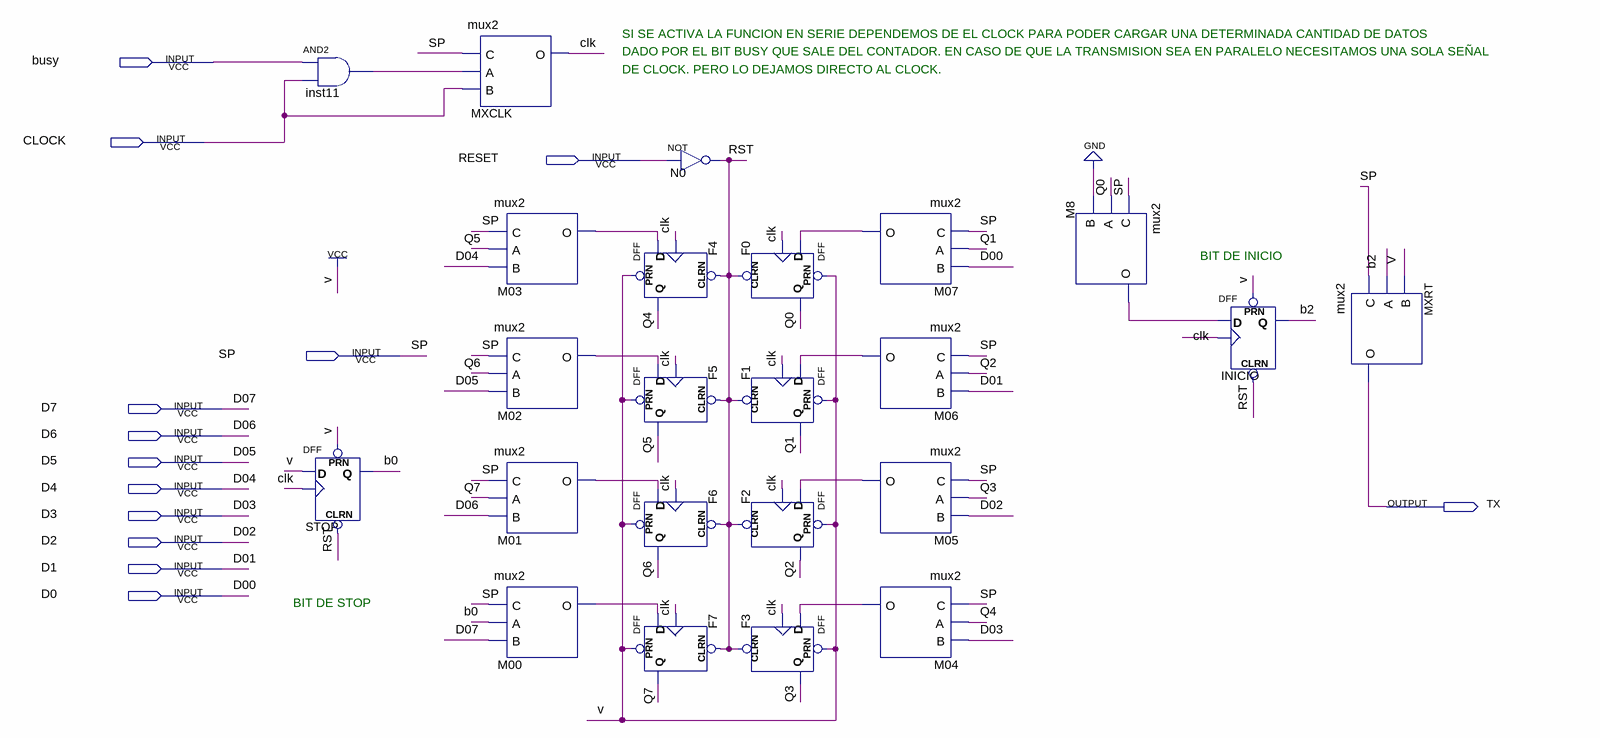
[diagram p0: schematic sheet]
// Quartus schematic Transmisor.bdf as structural Verilog: 23 symbols, 13 pins
module Transmisor (
  input  busy,
  input  CLOCK,
  input  RESET,
  input  SP,
  input  D7,
  input  D6,
  input  D5,
  input  D4,
  input  D3,
  input  D2,
  input  D1,
  input  D0,
  output TX
);

  wire b0, b2, clk, inst11_out, M00_o, M01_o, M02_o, M03_o, M04_o, M05_o, M06_o, M07_o, M8_o, Q0, Q1, Q2, Q3,
       Q4, Q5, Q6, Q7, RST;

  and inst11 (inst11_out, busy, CLOCK);
  DFF STOP (.CLRN(RST), .CLK(clk), .D(1'b1), .PRN(1'b1), .Q(b0));
  mux2 MXCLK (.C(SP), .A(inst11_out), .B(CLOCK), .O(clk));
  mux2 M03 (.C(SP), .A(Q5), .B(D4), .O(M03_o));
  mux2 M02 (.C(SP), .A(Q6), .B(D5), .O(M02_o));
  mux2 M01 (.C(SP), .A(Q7), .B(D6), .O(M01_o));
  mux2 M00 (.C(SP), .A(b0), .B(D7), .O(M00_o));
  not N0 (RST, RESET);
  DFF F4 (.CLRN(RST), .CLK(clk), .D(M03_o), .PRN(1'b1), .Q(Q4));
  DFF F5 (.CLRN(RST), .CLK(clk), .D(M02_o), .PRN(1'b1), .Q(Q5));
  DFF F6 (.CLRN(RST), .CLK(clk), .D(M01_o), .PRN(1'b1), .Q(Q6));
  DFF F7 (.CLRN(RST), .CLK(clk), .D(M00_o), .PRN(1'b1), .Q(Q7));
  DFF F0 (.CLRN(RST), .CLK(clk), .D(M07_o), .PRN(1'b1), .Q(Q0));
  DFF F1 (.CLRN(RST), .CLK(clk), .D(M06_o), .PRN(1'b1), .Q(Q1));
  DFF F2 (.CLRN(RST), .CLK(clk), .D(M05_o), .PRN(1'b1), .Q(Q2));
  DFF F3 (.CLRN(RST), .CLK(clk), .D(M04_o), .PRN(1'b1), .Q(Q3));
  mux2 M07 (.C(SP), .A(Q1), .B(D0), .O(M07_o));
  mux2 M06 (.C(SP), .A(Q2), .B(D1), .O(M06_o));
  mux2 M05 (.C(SP), .A(Q3), .B(D2), .O(M05_o));
  mux2 M04 (.C(SP), .A(Q4), .B(D3), .O(M04_o));
  mux2 M8 (.C(SP), .A(Q0), .B(1'b0), .O(M8_o));
  DFF INICIO (.CLRN(RST), .CLK(clk), .D(M8_o), .PRN(1'b1), .Q(b2));
  mux2 MXRT (.C(SP), .A(b2), .B(1'b1), .O(TX));

  // Other names for the same wires on the sheet: D00 = D0; D01 = D1; D02 = D2; D03 = D3; D04 = D4; D05 = D5; D06 = D6;
  //   D07 = D7

  // Notes on the sheet:
  //   SI SE ACTIVA LA FUNCION EN SERIE DEPENDEMOS DE EL CLOCK PARA PODER CARGAR UNA DETERMINADA CANTIDAD DE DATOS
  //   DADO POR EL BIT BUSY QUE SALE DEL CONTADOR. EN CASO DE QUE LA TRANSMISION SEA EN PARALELO NECESITAMOS UNA SOLA SEÑAL
  //   DE CLOCK. PERO LO DEJAMOS DIRECTO AL CLOCK.
  //   BIT DE INICIO
  //   BIT DE STOP
endmodule
